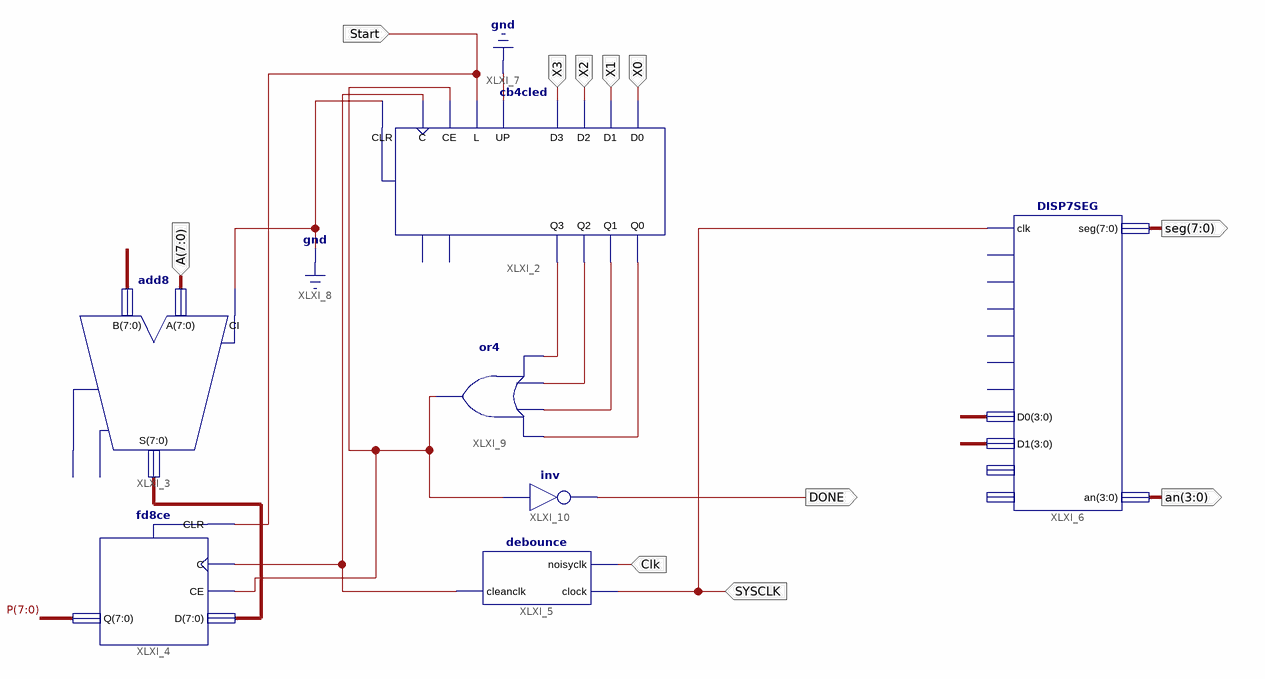
[diagram p0: schematic sheet 1]
// Xilinx ISE schematic bit4multi.sch (spartan6) as structural Verilog: 7 symbols, 11 ports
module bit4multi (
  input  Start,
  input  X0,
  input  X1,
  input  X2,
  input  X3,
  input  [7:0] A,
  input  Clk,
  input  SYSCLK,
  output [7:0] seg,
  output [3:0] an,
  output DONE
);

  wire XLXN_14, XLXN_15, XLXN_16, XLXN_17, XLXN_19, XLXN_20;
  wire [7:0] P, XLXN_7;

  cb4cled XLXI_2 (
    .C(XLXN_19), .CE(XLXN_20), .CLR(1'b0), .D0(X0), .D1(X1), .D2(X2), .D3(X3), .L(Start), .UP(1'b0),
    .Q0(XLXN_17), .Q1(XLXN_16), .Q2(XLXN_15), .Q3(XLXN_14));  // open: CEO, TC
  add8 XLXI_3 (.A(A), .B(P), .CI(1'b0), .S(XLXN_7));  // open: CO, OFL
  fd8ce XLXI_4 (.C(XLXN_19), .CE(XLXN_20), .CLR(Start), .D(XLXN_7), .Q(P));
  debounce XLXI_5 (.clock(SYSCLK), .noisyclk(Clk), .cleanclk(XLXN_19));
  DISP7SEG XLXI_6 (
    .clk(SYSCLK), .D0(P[3:0]), .D1(P[7:4]), .seg(seg), .an(an));  // open: text_mode, slow, med, fast, error, wrong, D2, D3
  or XLXI_9 (XLXN_20, XLXN_14, XLXN_15, XLXN_16, XLXN_17);
  not XLXI_10 (DONE, XLXN_20);
endmodule
